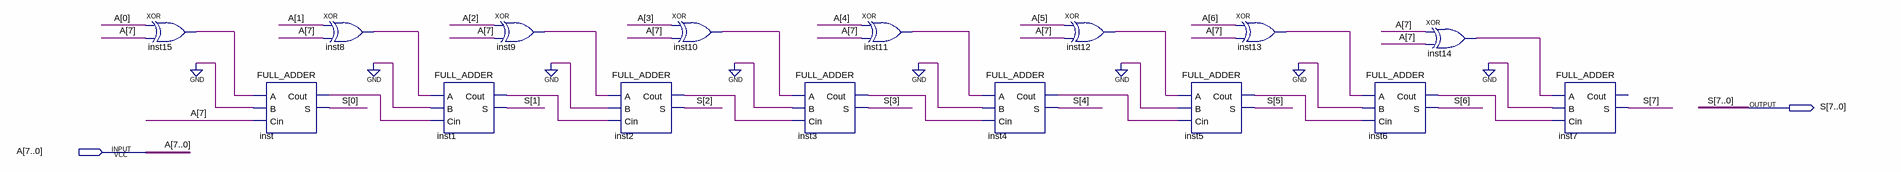
[diagram p0: schematic sheet]
// Quartus schematic TCC.bdf as structural Verilog: 16 symbols, 2 pins
module TCC (
  input  [7:0] A,
  output [7:0] S
);

  wire inst1_cout, inst2_cout, inst3_cout, inst4_cout, inst5_cout, inst6_cout, inst8_out, inst9_out,
       inst10_out, inst11_out, inst12_out, inst13_out, inst14_out, inst15_out, inst_cout;

  xor inst15 (inst15_out, A[0], A[7]);
  FULL_ADDER inst (.A(inst15_out), .B(1'b0), .Cin(A[7]), .Cout(inst_cout), .S(S[0]));
  xor inst8 (inst8_out, A[1], A[7]);
  FULL_ADDER inst1 (.A(inst8_out), .B(1'b0), .Cin(inst_cout), .Cout(inst1_cout), .S(S[1]));
  xor inst9 (inst9_out, A[2], A[7]);
  FULL_ADDER inst2 (.A(inst9_out), .B(1'b0), .Cin(inst1_cout), .Cout(inst2_cout), .S(S[2]));
  xor inst10 (inst10_out, A[3], A[7]);
  FULL_ADDER inst3 (.A(inst10_out), .B(1'b0), .Cin(inst2_cout), .Cout(inst3_cout), .S(S[3]));
  xor inst11 (inst11_out, A[4], A[7]);
  FULL_ADDER inst4 (.A(inst11_out), .B(1'b0), .Cin(inst3_cout), .Cout(inst4_cout), .S(S[4]));
  xor inst12 (inst12_out, A[5], A[7]);
  FULL_ADDER inst5 (.A(inst12_out), .B(1'b0), .Cin(inst4_cout), .Cout(inst5_cout), .S(S[5]));
  xor inst13 (inst13_out, A[6], A[7]);
  FULL_ADDER inst6 (.A(inst13_out), .B(1'b0), .Cin(inst5_cout), .Cout(inst6_cout), .S(S[6]));
  xor inst14 (inst14_out, A[7], A[7]);
  FULL_ADDER inst7 (.A(inst14_out), .B(1'b0), .Cin(inst6_cout), .S(S[7]));  // open: Cout
endmodule
